# Altium schematic sheet power section.SchDoc
size A4; SheetNumber: 2; SheetTotal: 4
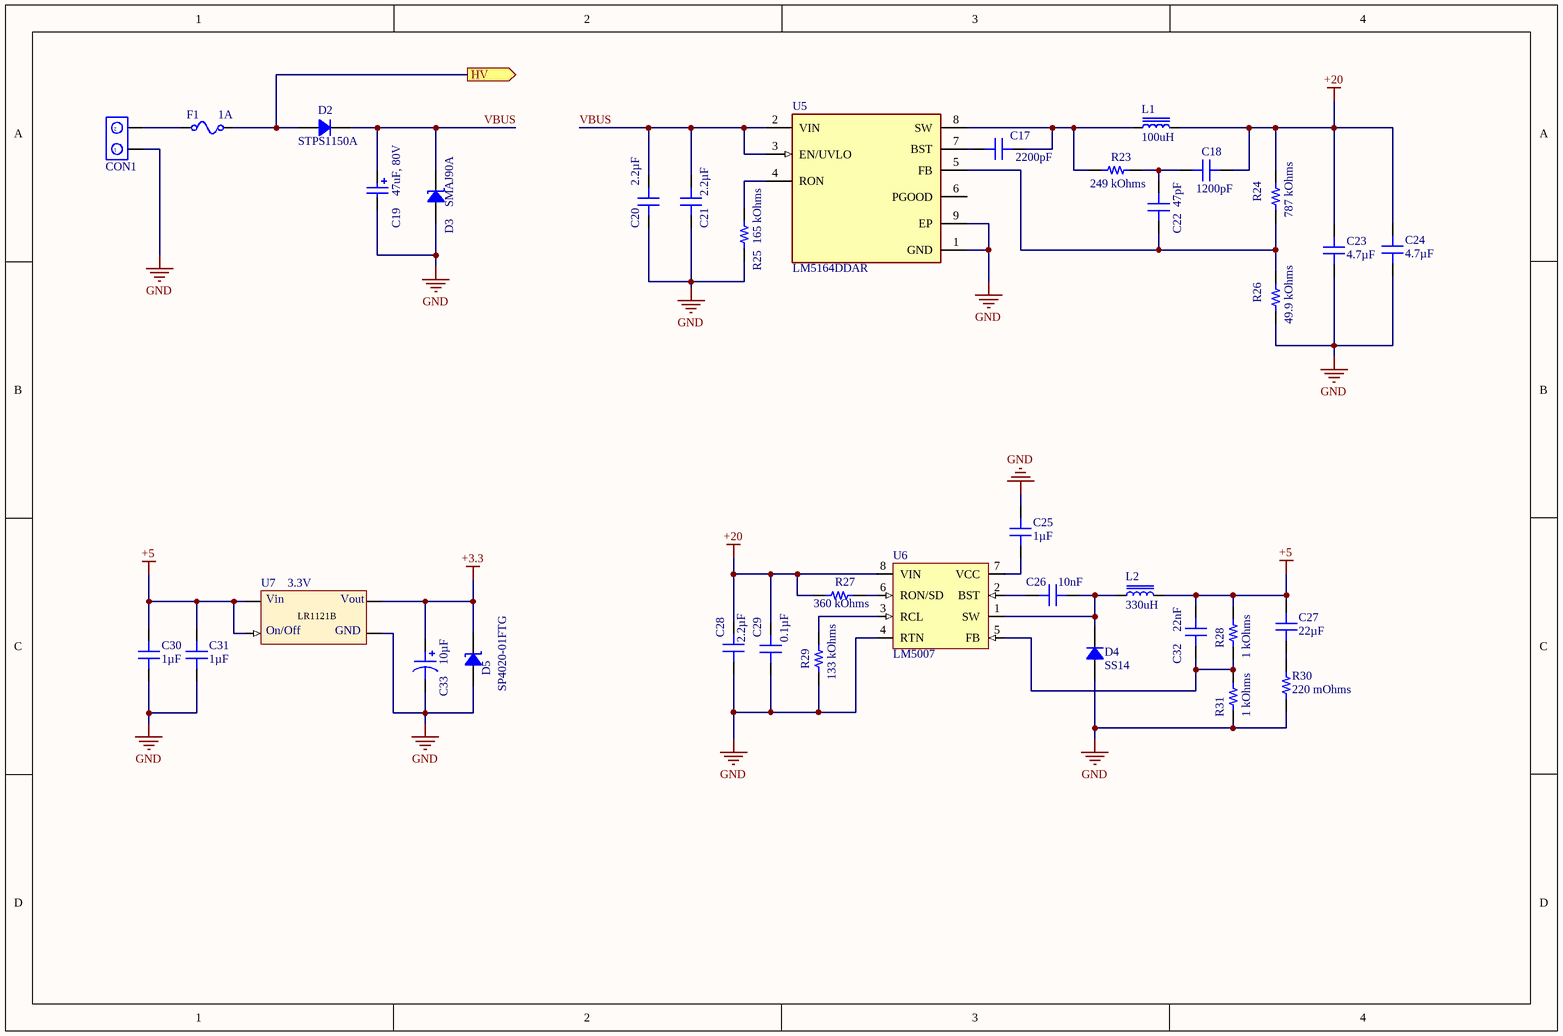
[diagram p0: power section.SchDoc]

## Parts
C17  2200pF  [CAP 1206_3216 - 1.2MM]
C18  1200pF  [CAP 0603_1608]
C19  47uF, 80V  [WCAP-ASLI_D10H10.5]
C20  2.2µF  [CAP 1210_3225 - 2.8MM]
C21  2.2µF  [CAP 1210_3225 - 2.8MM]
C22  47pF  [CAP 0603_1608]
C23  4.7µF  [CAP 0805_2012]
C24  4.7µF  [CAP 0805_2012]
C25  1µF  [CAP 0805_2012]
C26  10nF  [CAP 0402_1005]
C27  22µF  [CAP 1210_3225 - 2.8MM]
C28  2.2µF  [CAP 1206_3216 - 1.0MM]
C29  0.1µF  [CAP 0805_2012]
C30  1µF  [CAP 0402_1005]
C31  1µF  [CAP 0402_1005]
C32  22nF  [CAP 0603_1608]
C33  10µF  [CAP POL 1206_3216]
CON1  DG301-5.0-02P-12-00AH  [DG301-5.0-02P-12-00AH]  (value not drawn)
D2  STPS1150A  [DO214AC SMA]
D3  SMAJ90A  [DO214AC SMA]
D4  SS14  [DO214AC SMA]
D5  SP4020-01FTG  [SOD323]
F1  1A  [5x20 fuse holder clip R3-5A]
L1  100uH  [WE-PD_1245]
L2  330uH  [WE-PD_1245]
R23  249 kOhms  [RES 1206_3216]
R24  787 kOhms  [RES 1206_3216]
R25  165 kOhms  [RES 1206_3216]
R26  49.9 kOhms  [RES 1206_3216]
R27  360 kOhms  [RES 1206_3216]
R28  1 kOhms  [RES 1206_3216]
R29  133 kOhms  [RES 1206_3216]
R30  220 mOhms  [RES 1206_3216]
R31  1 kOhms  [RES 1206_3216]
U5  LM5164DDAR  [FP-DDA0008E-IPC_A]
U6  LM5007  [DGK0008A_L]
U7  3.3V  [SOT25_LR2111]

## Ports
HV (out)

## Nets
+3.3: C33.1 D5.2 U7.1(Vout)
+5: C27.2 C30.2 C31.2 C32.2 L2.2 R28.2 U7.3(Vin) U7.4(ON/OFF)
+20: C18.1 C23.2 C24.2 C28.2 C29.2 L1.2 R24.2 R27.1 U6.8(VIN)
GND: C19.2(N) C20.1 C21.1 C23.1 C24.1 C25.1 C28.1 C29.1 C30.1 C31.1 C33.2 CON1.1 D3.1 D4.1 D5.1 R25.1 R26.1 R29.1 R30.1 R31.1 U5.1(GND) U5.9(EP) U6.4(RTN) U7.2(Vss)
HV: D2.1 F1.2 ; port HV
VBUS: C19.1(P) C20.2 C21.2 D2.2 D3.2 U5.2(VIN) U5.3(EN/UVLO)
NetC17_1: C17.1 L1.1 R23.2 U5.8(SW)
NetC17_2: C17.2 U5.7(BST)
NetC18_2: C18.2 C22.2 R23.1
NetC22_1: C22.1 R24.1 R26.2 U5.5(FB)
NetC25_2: C25.2 U6.7(VCC)
NetC26_1: C26.1 U6.2(BST)
NetC26_2: C26.2 D4.2 L2.1 U6.1(SW)
NetC27_1: C27.1 R30.2
NetC32_1: C32.1 R28.1 R31.2 U6.5(FB)
NetCON1_2: CON1.2 F1.1
NetR25_2: R25.2 U5.4(RON)
NetR27_2: R27.2 U6.6(RON/SD)
NetR29_2: R29.2 U6.3(RCL)

Not connected (* = marked no-connect by the designer): U5 6(PGOOD)

## Notes on the sheet
- (in symbol LR1121B_3V3) LR1121B; On/Off; GND

## Library data of the parts
C17 = C1206C222K1GECAUTO: CAP CER 1206 2.2NF 100V C0G; Manufacturer: KEMET; Temperature Coefficient: C0G, NP0; Tolerance: ±10%; Part Number: C1206C222K1GECAUTO; Value: 2200pF; Applications: Automotive, ESD Protection; Capacitance: 2200pF; ComponentLink1Description: Datasheet; ComponentLink1URL: https://api.kemet.com/component-edge/download/datasheet/C1206C222K1GECAUTO.pdf; ComponentLink2Description: DigiKey Link; ComponentLink2URL: http://digikey.com/product-detail/en/kemet/C1206C222K1GECAUTO/399-17910-1-ND/8640577; Device Package: 1206 (3216 Metric); Features: Low ESL; LastUpdated: 9/2/2020 1:05:08 AM; Lifecycle Status: Active; Minimum Order: 1; Mounting Type: Surface Mount, MLCC; Operating Temperature: -55°C ~ 125°C; Package / Case: 1206 (3216 Metric); Packaging: TapeAndReel; PartId: 19238; Part Status: Active; Price: 0.07; Ratings: AEC-Q200; Series: ESD SMD Auto C0G; Size / Dimension: 0.126" L x 0.063" W (3.20mm x 1.60mm); Supplier 1: DigiKey; Supplier Part Number 1: 399-17910-1-ND; Thickness (Max): 0.047" (1.20mm); Voltage - Rated: 100V
C18 = C0603C122K1RAC7867: CAP CER 1200PF 100V X7R 0603; Manufacturer: KEMET; Tolerance: ±10%; Part Number: C0603C122K1RAC7867; Value: 1200pF; Applications: Bypass, Decoupling; Capacitance: 1200pF; ComponentLink1Description: Datasheet; ComponentLink1URL: https://api.kemet.com/component-edge/download/datasheet/C0603C122K1RACTU.pdf; ComponentLink2Description: DigiKey Link; ComponentLink2URL: http://digikey.com/product-detail/en/kemet/C0603C122K1RAC7867/399-15358-1-ND/7386756; Device Package: 0603 (1608 Metric); LastUpdated: 9/2/2020 1:03:35 AM; Lifecycle Status: Active; Minimum Order: 1; Mounting Type: Surface Mount, MLCC; Operating Temperature: -55°C ~ 125°C; Package / Case: 0603 (1608 Metric); Packaging: TapeAndReel; PartId: 2381; Part Status: Active; Price: 0.08; Series: SMD Comm X7R; Size / Dimension: 0.063" L x 0.031" W (1.60mm x 0.80mm); Supplier 1: DigiKey; Supplier Part Number 1: 399-15358-1-ND; Temperature Coefficient: X7R; Thickness (Max): 0.034" (0.87mm); Voltage - Rated: 100V
C19 = 865081757008: WCAP-ASLI Aluminum Electrolytic Capacitor, V-Chip, SMT, D10xH10.5mm, 47uF, 80V; Manufacturer: Wurth Elektronik; Technical Reference: ASEF105470M080DVCTEB000; Ripple Current: 160mA; Capacitance Tolerance: +/-20%; Leakage Current: 37.6uA; Endurance: 2000h; Dissipation Factor: 10%; Rated Voltage: 80VDC; Packaging: Tape and Reel; Published Date: October 2020; Operating Temperature: -55 to +105degC; Mounting Technology: SMT; Manufacturer Part Number: 865081757008; Height: 10.5mm; Capacitance: 47uF; ComponentLink1Description: Manufacturer; ComponentLink1URL: http://www.we-online.de; ComponentLink2Description: Datasheet; ComponentLink2URL: https://www.we-online.com/catalog/datasheet/865081757008.pdf; Diameter: 10mm
C20 C21 = HMK325B7225KM-P: CAP CER 2.2UF 100V X7R 1210; Manufacturer: Taiyo Yuden; Temperature Coefficient: X7R (2R1); Tolerance: ±10%; Part Number: HMK325B7225KM-P; Value: 2.2µF; Applications: Automotive, SMPS Filtering; Capacitance: 2.2µF; ComponentLink1Description: Datasheet; ComponentLink1URL: https://ds.yuden.co.jp/TYCOMPAS/ut/detail?pn=HMK325B7225KM-P &u=M; ComponentLink2Description: DigiKey Link; ComponentLink2URL: http://digikey.com/product-detail/en/taiyo-yuden/HMK325B7225KM-P/587-5395-1-ND/7066257; Device Package: 1210 (3225 Metric); LastUpdated: 9/2/2020 1:10:53 AM; Lifecycle Status: Active; Minimum Order: 1; Mounting Type: Surface Mount, MLCC; Operating Temperature: -55°C ~ 125°C; Package / Case: 1210 (3225 Metric); Packaging: TapeAndReel; PartId: 23634; Part Status: Active; Price: 0.15; Ratings: AEC-Q200; Series: M; Size / Dimension: 0.126" L x 0.098" W (3.20mm x 2.50mm); Supplier 1: DigiKey; Supplier Part Number 1: 587-5395-1-ND; Thickness (Max): 0.106" (2.70mm); Voltage - Rated: 100V
C22 = 06031A470FAT2A: CAP CER 47PF 100V C0G/NP0 0603; Manufacturer: AVX Corporation; Temperature Coefficient: C0G, NP0; Tolerance: ±1%; Part Number: 06031A470FAT2A; Value: 47pF; Applications: General Purpose; Capacitance: 47pF; ComponentLink1Description: Datasheet; ComponentLink1URL: http://datasheets.avx.com/C0GNP0-Dielectric.pdf; ComponentLink2Description: DigiKey Link; ComponentLink2URL: http://digikey.com/product-detail/en/avx-corporation/06031A470FAT2A/478-3691-1-ND/1116389; Device Package: 0603 (1608 Metric); LastUpdated: 9/2/2020 1:03:35 AM; Lifecycle Status: Active; Minimum Order: 1; Mounting Type: Surface Mount, MLCC; Operating Temperature: -55°C ~ 125°C; Package / Case: 0603 (1608 Metric); Packaging: TapeAndReel; PartId: 2637; Part Status: Active; Price: 0.10; Series: -; Size / Dimension: 0.063" L x 0.032" W (1.60mm x 0.81mm); Supplier 1: DigiKey; Supplier Part Number 1: 478-3691-1-ND; Thickness (Max): 0.035" (0.90mm); Voltage - Rated: 100V
C23 C24 = CL21A475KBQNNNE: CAP CER 4.7UF 50V X5R 0805; Manufacturer: Samsung Electro-Mechanics; Tolerance: ±10%; Part Number: CL21A475KBQNNNE; Value: 4.7µF; Applications: General Purpose; Capacitance: 4.7µF; ComponentLink1Description: Datasheet; ComponentLink1URL: http://www.samsungsem.com/kr/support/product-search/mlcc/CL21A475KBQNNNE.jsp; ComponentLink2Description: DigiKey Link; ComponentLink2URL: http://digikey.com/product-detail/en/samsung-electro-mechanics/CL21A475KBQNNNE/1276-1248-1-ND/3889334; Device Package: 0805 (2012 Metric); LastUpdated: 9/2/2020 1:04:41 AM; Lifecycle Status: Active; Minimum Order: 1; Mounting Type: Surface Mount, MLCC; Operating Temperature: -55°C ~ 85°C; Package / Case: 0805 (2012 Metric); Packaging: TapeAndReel; PartId: 3027; Part Status: Active; Price: 0.10; Series: CL; Size / Dimension: 0.079" L x 0.049" W (2.00mm x 1.25mm); Supplier 1: DigiKey; Supplier Part Number 1: 1276-1248-1-ND; Temperature Coefficient: X5R; Thickness (Max): 0.055" (1.40mm); Voltage - Rated: 50V
C25 = GCM21BR71H105KA03L: CAP CER 1UF 50V X7R 0805; Manufacturer: Murata Electronics; Tolerance: ±10%; Part Number: GCM21BR71H105KA03L; Value: 1µF; Applications: Automotive; Capacitance: 1µF; ComponentLink1Description: Datasheet; ComponentLink1URL: https://www.murata.com/~/media/webrenewal/support/library/catalog/products/capacitor/mlcc/c03e.ashx?la=en-us; ComponentLink2Description: DigiKey Link; ComponentLink2URL: http://digikey.com/product-detail/en/murata-electronics/GCM21BR71H105KA03L/490-10675-1-ND/5251430; Device Package: 0805 (2012 Metric); LastUpdated: 9/2/2020 1:04:41 AM; Lifecycle Status: Active; Minimum Order: 1; Mounting Type: Surface Mount, MLCC; Operating Temperature: -55°C ~ 125°C; Package / Case: 0805 (2012 Metric); Packaging: TapeAndReel; PartId: 2659; Part Status: Active; Price: 0.08; Ratings: AEC-Q200; Series: GCM; Size / Dimension: 0.079" L x 0.049" W (2.00mm x 1.25mm); Supplier 1: DigiKey; Supplier Part Number 1: 490-10675-1-ND; Temperature Coefficient: X7R; Thickness (Max): 0.055" (1.40mm); Voltage - Rated: 50V
C26 = C0402C103K4RECAUTO: CAP CER 0402 10NF 16V X7R 10%; Manufacturer: KEMET; Capacitance: 10000pF; Voltage - Rated: 50V; Part Number: C0402C103K4RECAUTO; Value: 10nF; Applications: Automotive, ESD Protection; ComponentLink1Description: Datasheet; ComponentLink1URL: https://api.kemet.com/component-edge/download/datasheet/C0402C103K4RECAUTO.pdf; ComponentLink2Description: DigiKey Link; ComponentLink2URL: http://digikey.com/product-detail/en/kemet/C0402C103K4RECAUTO/399-17876-1-ND/8640543; Device Package: 0402 (1005 Metric); LastUpdated: 9/2/2020 1:02:25 AM; Lifecycle Status: Active; Minimum Order: 1; Mounting Type: Surface Mount, MLCC; Operating Temperature: -55°C ~ 125°C; Package / Case: 0402 (1005 Metric); Packaging: TapeAndReel; PartId: 1725; Part Status: Active; Price: 0.02; Ratings: AEC-Q200; Series: ESD SMD Auto X7R; Size / Dimension: 0.039" L x 0.020" W (1.00mm x 0.50mm); Supplier 1: DigiKey; Supplier Part Number 1: 399-17876-1-ND; Temperature Coefficient: X7R; Thickness (Max): 0.022" (0.55mm); Tolerance: ±10%
C27 = C3225X7R1E226M250AB: CAP CER 22UF 25V X7R 1210; Manufacturer: TDK Corporation; Tolerance: ±20%; Part Number: C3225X7R1E226M250AB; Value: 22µF; Applications: General Purpose; Capacitance: 22µF; ComponentLink1Description: Datasheet; ComponentLink1URL: https://product.tdk.com/en/search/capacitor/ceramic/mlcc/info?part_no=C2012X7S1E106K125AC?ref_disty=digikey; ComponentLink2Description: DigiKey Link; ComponentLink2URL: http://digikey.com/product-detail/en/tdk-corporation/C3225X7R1E226M250AB/445-181602-1-ND/9991480; Device Package: 1210 (3225 Metric); Features: Low ESL; LastUpdated: 9/2/2020 1:10:53 AM; Lifecycle Status: Active; Minimum Order: 1; Mounting Type: Surface Mount, MLCC; Operating Temperature: -55°C ~ 125°C; Package / Case: 1210 (3225 Metric); Packaging: TapeAndReel; PartId: 23664; Part Status: Active; Price: 0.63; Series: C; Size / Dimension: 0.126" L x 0.098" W (3.20mm x 2.50mm); Supplier 1: DigiKey; Supplier Part Number 1: 445-181602-1-ND; Temperature Coefficient: X7R; Thickness (Max): 0.110" (2.80mm); Voltage - Rated: 25V
C28 = UMK316B7225MD-T: CAP CER 2.2UF 50V X7R 1206; Manufacturer: Taiyo Yuden; Tolerance: ±20%; Part Number: UMK316B7225MD-T; Value: 2.2µF; Applications: General Purpose; Capacitance: 2.2µF; ComponentLink1Description: Datasheet; ComponentLink1URL: https://ds.yuden.co.jp/TYCOMPAS/ut/detail?pn=UMK316B7225MD-T  &u=M; ComponentLink2Description: DigiKey Link; ComponentLink2URL: http://digikey.com/product-detail/en/taiyo-yuden/UMK316B7225MD-T/587-5601-1-ND/7067276; Device Package: 1206 (3216 Metric); LastUpdated: 9/2/2020 1:05:04 AM; Lifecycle Status: Active; Minimum Order: 1; Mounting Type: Surface Mount, MLCC; Operating Temperature: -55°C ~ 125°C; Package / Case: 1206 (3216 Metric); Packaging: TapeAndReel; PartId: 19453; Part Status: Active; Price: 0.08; Series: M; Size / Dimension: 0.126" L x 0.063" W (3.20mm x 1.60mm); Supplier 1: DigiKey; Supplier Part Number 1: 587-5601-1-ND; Temperature Coefficient: X7R; Thickness (Max): 0.037" (0.95mm); Voltage - Rated: 50V
C29 = AC0805KKX8R9BB104: CAP CER 0805 10% X8R 50V 100NF; Manufacturer: Yageo; Part Number: AC0805KKX8R9BB104; Value: 0.1µF; Applications: Automotive; Capacitance: 0.1µF; ComponentLink1Description: Datasheet; ComponentLink1URL: http://www.yageo.com/documents/recent/AC0805KKX8R9BB104.pdf; ComponentLink2Description: DigiKey Link; ComponentLink2URL: http://digikey.com/product-detail/en/yageo/AC0805KKX8R9BB104/311-4624-1-ND/9699550; Device Package: 0805 (2012 Metric); LastUpdated: 9/2/2020 1:04:20 AM; Lifecycle Status: Active; Minimum Order: 1; Mounting Type: Surface Mount, MLCC; Operating Temperature: -55°C ~ 150°C; Package / Case: 0805 (2012 Metric); Packaging: TapeAndReel; PartId: 14076; Part Status: Active; Price: 0.06; Ratings: AEC-Q200; Series: AC; Size / Dimension: 0.079" L x 0.049" W (2.00mm x 1.25mm); Supplier 1: DigiKey; Supplier Part Number 1: 311-4624-1-ND; Temperature Coefficient: X8R; Thickness (Max): 0.057" (1.45mm); Tolerance: ±10%; Voltage - Rated: 50V
C30 C31 = GRM155C71A105KE11D: CAP CER 1UF 10V X7S 0402; Manufacturer: Murata Electronics; Tolerance: ±10%; Part Number: GRM155C71A105KE11D; Value: 1µF; Applications: General Purpose; Capacitance: 1µF; ComponentLink1Description: Datasheet; ComponentLink1URL: https://search.murata.co.jp/Ceramy/image/img/A01X/G101/ENG/GRM155C71A105KE11-01.pdf; ComponentLink2Description: DigiKey Link; ComponentLink2URL: http://digikey.com/product-detail/en/murata-electronics/GRM155C71A105KE11D/490-14457-1-ND/6606918; Device Package: 0402 (1005 Metric); LastUpdated: 9/2/2020 1:02:25 AM; Lifecycle Status: Active; Minimum Order: 1; Mounting Type: Surface Mount, MLCC; Operating Temperature: -55°C ~ 125°C; Package / Case: 0402 (1005 Metric); Packaging: TapeAndReel; PartId: 1749; Part Status: Active; Price: 0.08; Series: GRM; Size / Dimension: 0.039" L x 0.020" W (1.00mm x 0.50mm); Supplier 1: DigiKey; Supplier Part Number 1: 490-14457-1-ND; Temperature Coefficient: X7S; Thickness (Max): 0.024" (0.60mm); Voltage - Rated: 10V
C32 = 06035C222JAT2A: CAP CER 2200PF 50V X7R 0603; Manufacturer: AVX Corporation; Tolerance: ±5%; Part Number: 06035C222JAT2A; Value: 22nF; Applications: General Purpose; Capacitance: 2200pF; ComponentLink1Description: Datasheet; ComponentLink1URL: http://datasheets.avx.com/X7RDielectric.pdf; ComponentLink2Description: DigiKey Link; ComponentLink2URL: http://digikey.com/product-detail/en/avx-corporation/06035C222JAT2A/478-6205-1-ND/2391404; Device Package: 0603 (1608 Metric); LastUpdated: 9/2/2020 1:03:35 AM; Lifecycle Status: Active; Minimum Order: 1; Mounting Type: Surface Mount, MLCC; Operating Temperature: -55°C ~ 125°C; Package / Case: 0603 (1608 Metric); Packaging: TapeAndReel; PartId: 2770; Part Status: Active; Price: 0.02; Series: -; Size / Dimension: 0.063" L x 0.032" W (1.60mm x 0.81mm); Supplier 1: DigiKey; Supplier Part Number 1: 478-6205-1-ND; Temperature Coefficient: X7R; Thickness (Max): 0.035" (0.90mm); Voltage - Rated: 50V
C33 = T491S106K010AT: CAP TANT 10UF 10% 10V 1206; Manufacturer: KEMET; Manufacturer Size Code: S; ESR (Equivalent Series Resistance): 15Ohm; Lifetime @ Temp.: 2000 Hrs @ 125°C; Type: Molded; Part Number: T491S106K010AT; Value: 10µF; Capacitance: 10µF; ComponentLink1Description: Datasheet; ComponentLink1URL: https://api.kemet.com/component-edge/download/datasheet/T491S106K010AT.pdf; ComponentLink2Description: DigiKey Link; ComponentLink2URL: http://digikey.com/product-detail/en/kemet/T491S106K010AT/399-9747-1-ND/3724860; Device Package: 1206 (3216 Metric); Features: General Purpose; Height - Seated (Max): 0.047" (1.20mm); LastUpdated: 9/2/2020 1:15:59 AM; Lifecycle Status: Active; Minimum Order: 1; Mounting Type: Surface Mount; Operating Temperature: -55°C ~ 125°C; Package / Case: 1206 (3216 Metric); Packaging: TapeAndReel; PartId: 113; Part Status: Active; Price: 0.48; Series: T491; Size / Dimension: 0.126" L x 0.063" W (3.20mm x 1.60mm); Supplier 1: DigiKey; Supplier Part Number 1: 399-9747-1-ND; Tolerance: ±10%; Voltage - Rated: 10V
D2 = STPS1150A: DIODE SCHOTTKY 150V 1A SMA; Manufacturer: STMicroelectronics; Current - Reverse Leakage @ Vr: 1µA @ 150V; Speed: Fast Recovery =< 500ns, > 200mA (Io); Voltage - Forward (Vf) (Max) @ If: 820mV @ 1A; Part Number: STPS1150A; ComponentLink1Description: Datasheet; ComponentLink1URL: http://www.st.com/content/ccc/resource/technical/document/datasheet/c8/2f/54/15/4c/14/44/bb/CD00003321.pdf/files/CD00003321.pdf/jcr:content/translations/en.CD00003321.pdf; ComponentLink2Description: DigiKey Link; ComponentLink2URL: http://digikey.com/product-detail/en/stmicroelectronics/STPS1150A/497-7545-1-ND/1883390; Current - Average Rectified (Io): 1A; Diode Type: Schottky; LastUpdated: 9/2/2020 1:19:02 AM; Lifecycle Status: Active; Minimum Order: 1; Mounting Type: Surface Mount; Operating Temperature - Junction: 175°C (Max); Package / Case: DO-214AC, SMA; Packaging: TapeAndReel; PartId: 2076; Part Status: Active; Price: 0.09; Series: -; Supplier 1: DigiKey; Supplier Part Number 1: 497-7545-1-ND; Supplier Device Package: SMA; Voltage - DC Reverse (Vr) (Max): 150V
D3 = SMAJ90A: TVS DIODE 90V 146V SMA; Manufacturer: AVX Corporation; Current - Peak Pulse (10/1000µs): 2.74A; Power Line Protection: No; Power - Peak Pulse: 400W; Type: Zener; Unidirectional Channels: 1; Voltage - Breakdown (Min): 100V; Part Number: SMAJ90A; Applications: General Purpose; ComponentLink1Description: Datasheet; ComponentLink1URL: //media.digikey.com/pdf/Data%20Sheets/AVX%20PDFs/Transient%20Suppression%20Diodes.pdf; ComponentLink2Description: DigiKey Link; ComponentLink2URL: http://digikey.com/product-detail/en/avx-corporation/SMAJ90A/478-7059-1-ND/3340336; LastUpdated: 9/2/2020 1:20:14 AM; Lifecycle Status: Active; Minimum Order: 1; Mounting Type: Surface Mount; Operating Temperature: -55°C ~ 150°C (TJ); Package / Case: DO-214AC, SMA; Packaging: TapeAndReel; PartId: 5678; Part Status: Active; Price: 0.10; Series: -; Supplier 1: DigiKey; Supplier Part Number 1: 478-7059-1-ND; Supplier Device Package: SMAJ (DO-214AC); Voltage - Clamping (Max) @ Ipp: 146V; Voltage - Reverse Standoff (Typ): 90V
D4 = SS14: DIODE SCHOTTKY 40V 1A SMA; Manufacturer: ON Semiconductor; Current - Reverse Leakage @ Vr: 200µA @ 40V; Speed: Fast Recovery =< 500ns, > 200mA (Io); Voltage - Forward (Vf) (Max) @ If: 500mV @ 1A; Part Number: SS14; ComponentLink1Description: Datasheet; ComponentLink1URL: https://www.onsemi.com/pub/Collateral/SS19-D.PDF; ComponentLink2Description: DigiKey Link; ComponentLink2URL: http://digikey.com/product-detail/en/on-semiconductor/SS14/SS14CT-ND/965729; Current - Average Rectified (Io): 1A; Diode Type: Schottky; LastUpdated: 9/2/2020 1:19:04 AM; Lifecycle Status: Active; Minimum Order: 1; Mounting Type: Surface Mount; Operating Temperature - Junction: -65°C ~ 125°C; Package / Case: DO-214AC, SMA; Packaging: TapeAndReel; PartId: 1885; Part Status: Active; Price: 0.06; Series: -; Supplier 1: DigiKey; Supplier Part Number 1: SS14CT-ND; Supplier Device Package: SMA (DO-214AC); Voltage - DC Reverse (Vr) (Max): 40V
D5 = SP4020-01FTG: TVS DIODE 3.3V 21.8V SOD323; Manufacturer: Littelfuse Inc.; Capacitance @ Frequency: 2.5pF @ 1MHz; Current - Peak Pulse (10/1000µs): 30A (8/20µs); Power Line Protection: No; Power - Peak Pulse: 750W; Type: Steering (Rail to Rail); Unidirectional Channels: 1; Voltage - Breakdown (Min): 3.5V; Voltage - Clamping (Max) @ Ipp: 21.8V (Typ); Voltage - Reverse Standoff (Typ): 3.3V (Max); Part Number: SP4020-01FTG; Applications: Ethernet; ComponentLink1Description: Datasheet; ComponentLink1URL: https://www.littelfuse.com/~/media/electronics/datasheets/tvs_diode_arrays/littelfuse_tvs_diode_array_sp4020_datasheet.pdf.pdf; ComponentLink2Description: DigiKey Link; ComponentLink2URL: http://digikey.com/product-detail/en/littelfuse-inc/SP4020-01FTG/F6270CT-ND/4579604; LastUpdated: 9/2/2020 1:28:27 AM; Lifecycle Status: Active; Minimum Order: 1; Mounting Type: Surface Mount; Operating Temperature: -40°C ~ 125°C (TJ); Package / Case: SC-76, SOD-323; Packaging: TapeAndReel; PartId: 9868; Part Status: Active; Price: 0.22; Series: SP4020, SPA®; Supplier 1: DigiKey; Supplier Part Number 1: F6270CT-ND; Supplier Device Package: SOD-323
F1 = 5x20 fuse: 5x20 fuse holder clip; Value: 1A
L1 = CDRH127-101M: 330uh 1A Shielded Fixed inductor COREMASTER; Current: 3.28A; DCR: 170m; Tolerance: 20%; Value: 100uH; Dimensions: 12x12x8; ComponentLink1Description: ozdisan; ComponentLink1URL: https://ozdisan.com/passive-components/inductors/fixed-inductors/SRI1204-331M
L2 = SRI1204-331M: 330uh 1A Shielded Fixed inductor COREMASTER; DCR: 800m; Tolerance: 20%; Value: 330uH; Current: 1A; Dimensions: 12x12x5; ComponentLink1Description: ozdisan; ComponentLink1URL: https://ozdisan.com/passive-components/inductors/fixed-inductors/SRI1204-331M
R23 = CRCW1206249KFKEA: RES SMD 249K OHM 1% 1/4W 1206; Manufacturer: Vishay Dale; Power (Watts): 0.25W, 1/4W; Temperature Coefficient: ±100ppm/°C; Part Number: CRCW1206249KFKEA; ComponentLink1Description: Datasheet; ComponentLink1URL: http://www.vishay.com/docs/20035/dcrcwe3.pdf; ComponentLink2Description: DigiKey Link; ComponentLink2URL: http://digikey.com/product-detail/en/vishay-dale/CRCW1206249KFKEA/541-249KFCT-ND/1182031; Composition: Thick Film; Device Package: 1206 (3216 Metric); Features: Automotive AEC-Q200; Height - Seated (Max): 0.024" (0.60mm); LastUpdated: 9/2/2020 1:13:11 AM; Lifecycle Status: Active; Minimum Order: 1; Number of Terminations: 2; Operating Temperature: -55°C ~ 155°C; Package / Case: 1206 (3216 Metric); Packaging: TapeAndReel; PartId: 26922; Part Status: Active; Price: 0.01; Ratings: AEC-Q200; Resistance: 249 kOhms; Series: CRCW; Size / Dimension: 0.126" L x 0.063" W (3.20mm x 1.60mm); Supplier 1: DigiKey; Supplier Part Number 1: 541-249KFCT-ND; Supplier Device Package: 1206; Tolerance: ±1%; Value: 249 kOhms
R24 = RMCF1206FT787K: RES 787K OHM 1% 1/4W 1206; Manufacturer: Stackpole Electronics Inc; Power (Watts): 0.25W, 1/4W; Temperature Coefficient: ±100ppm/°C; Part Number: RMCF1206FT787K; ComponentLink1Description: Datasheet; ComponentLink1URL: https://www.seielect.com/catalog/sei-rmcf_rmcp.pdf; ComponentLink2Description: DigiKey Link; ComponentLink2URL: http://digikey.com/product-detail/en/stackpole-electronics-inc/RMCF1206FT787K/RMCF1206FT787KCT-ND/5049901; Composition: Thick Film; Device Package: 1206 (3216 Metric); Features: Automotive AEC-Q200; Height - Seated (Max): 0.028" (0.70mm); LastUpdated: 9/2/2020 1:13:01 AM; Lifecycle Status: Active; Minimum Order: 1; Number of Terminations: 2; Operating Temperature: -55°C ~ 155°C; Package / Case: 1206 (3216 Metric); Packaging: CutTape; PartId: 30593; Part Status: Active; Price: 0.10; Ratings: AEC-Q200; Resistance: 787 kOhms; Series: RMCF; Size / Dimension: 0.126" L x 0.063" W (3.20mm x 1.60mm); Supplier 1: DigiKey; Supplier Part Number 1: RMCF1206FT787KCT-ND; Supplier Device Package: 1206; Tolerance: ±1%; Value: 787 kOhms
R25 = CRCW1206165KFKEA: RES SMD 165K OHM 1% 1/4W 1206; Manufacturer: Vishay Dale; Power (Watts): 0.25W, 1/4W; Temperature Coefficient: ±100ppm/°C; Part Number: CRCW1206165KFKEA; ComponentLink1Description: Datasheet; ComponentLink1URL: http://www.vishay.com/docs/20035/dcrcwe3.pdf; ComponentLink2Description: DigiKey Link; ComponentLink2URL: http://digikey.com/product-detail/en/vishay-dale/CRCW1206165KFKEA/541-165KFCT-ND/1182011; Composition: Thick Film; Device Package: 1206 (3216 Metric); Features: Automotive AEC-Q200; Height - Seated (Max): 0.024" (0.60mm); LastUpdated: 9/2/2020 1:13:03 AM; Lifecycle Status: Active; Minimum Order: 1; Number of Terminations: 2; Operating Temperature: -55°C ~ 155°C; Package / Case: 1206 (3216 Metric); Packaging: TapeAndReel; PartId: 29728; Part Status: Active; Price: 0.01; Ratings: AEC-Q200; Resistance: 165 kOhms; Series: CRCW; Size / Dimension: 0.126" L x 0.063" W (3.20mm x 1.60mm); Supplier 1: DigiKey; Supplier Part Number 1: 541-165KFCT-ND; Supplier Device Package: 1206; Tolerance: ±1%; Value: 165 kOhms
R26 = AC1206FR-0749K9L: RES SMD 49.9K OHM 1% 1/4W 1206; Manufacturer: Yageo; Power (Watts): 0.25W, 1/4W; Temperature Coefficient: ±100ppm/°C; Part Number: AC1206FR-0749K9L; ComponentLink1Description: Datasheet; ComponentLink1URL: https://www.yageo.com/upload/media/product/productsearch/datasheet/rchip/PYu-AC_51_RoHS_L_7.pdf; ComponentLink2Description: DigiKey Link; ComponentLink2URL: http://digikey.com/product-detail/en/yageo/AC1206FR-0749K9L/YAG5409CT-ND/7063752; Composition: Thick Film; Device Package: 1206 (3216 Metric); Features: Automotive AEC-Q200, Moisture Resistant; Height - Seated (Max): 0.026" (0.65mm); LastUpdated: 9/2/2020 1:13:11 AM; Lifecycle Status: Active; Minimum Order: 1; Number of Terminations: 2; Operating Temperature: -55°C ~ 155°C; Package / Case: 1206 (3216 Metric); Packaging: TapeAndReel; PartId: 26899; Part Status: Active; Price: 0.01; Ratings: AEC-Q200; Resistance: 49.9 kOhms; Series: AC; Size / Dimension: 0.122" L x 0.063" W (3.10mm x 1.60mm); Supplier 1: DigiKey; Supplier Part Number 1: YAG5409CT-ND; Supplier Device Package: 1206; Tolerance: ±1%; Value: 49.9 kOhms
R27 = RC1206FR-07360KL: RES SMD 360K OHM 1% 1/4W 1206; Manufacturer: Yageo; Power (Watts): 0.25W, 1/4W; Temperature Coefficient: ±100ppm/°C; Part Number: RC1206FR-07360KL; ComponentLink1Description: Datasheet; ComponentLink1URL: https://www.yageo.com/upload/media/product/productsearch/datasheet/rchip/PYu-RC_Group_51_RoHS_L_10.pdf; ComponentLink2Description: DigiKey Link; ComponentLink2URL: http://digikey.com/product-detail/en/yageo/RC1206FR-07360KL/311-360KFRCT-ND/731790; Composition: Thick Film; Device Package: 1206 (3216 Metric); Features: Moisture Resistant; Height - Seated (Max): 0.026" (0.65mm); LastUpdated: 9/2/2020 1:13:06 AM; Lifecycle Status: Active; Minimum Order: 1; Number of Terminations: 2; Operating Temperature: -55°C ~ 155°C; Package / Case: 1206 (3216 Metric); Packaging: TapeAndReel; PartId: 28271; Part Status: Active; Price: 0.01; Resistance: 360 kOhms; Series: RC; Size / Dimension: 0.122" L x 0.063" W (3.10mm x 1.60mm); Supplier 1: DigiKey; Supplier Part Number 1: 311-360KFRCT-ND; Supplier Device Package: 1206; Tolerance: ±1%; Value: 360 kOhms
R28 R31 = RC1206FR-071KL: RES SMD 1K OHM 1% 1/4W 1206; Manufacturer: Yageo; Power (Watts): 0.25W, 1/4W; Temperature Coefficient: ±100ppm/°C; Part Number: RC1206FR-071KL; ComponentLink1Description: Datasheet; ComponentLink1URL: https://www.yageo.com/upload/media/product/productsearch/datasheet/rchip/PYu-RC_Group_51_RoHS_L_10.pdf; ComponentLink2Description: DigiKey Link; ComponentLink2URL: http://digikey.com/product-detail/en/yageo/RC1206FR-071KL/311-1.00KFRCT-ND/731334; Composition: Thick Film; Device Package: 1206 (3216 Metric); Features: Moisture Resistant; Height - Seated (Max): 0.026" (0.65mm); LastUpdated: 9/2/2020 1:13:10 AM; Lifecycle Status: Active; Minimum Order: 1; Number of Terminations: 2; Operating Temperature: -55°C ~ 155°C; Package / Case: 1206 (3216 Metric); Packaging: TapeAndReel; PartId: 26978; Part Status: Active; Price: 0.01; Resistance: 1 kOhms; Series: RC; Size / Dimension: 0.122" L x 0.063" W (3.10mm x 1.60mm); Supplier 1: DigiKey; Supplier Part Number 1: 311-1.00KFRCT-ND; Supplier Device Package: 1206; Tolerance: ±1%; Value: 1 kOhms
R29 = RC1206FR-07133KL: RES SMD 133K OHM 1% 1/4W 1206; Manufacturer: Yageo; Power (Watts): 0.25W, 1/4W; Temperature Coefficient: ±100ppm/°C; Part Number: RC1206FR-07133KL; ComponentLink1Description: Datasheet; ComponentLink1URL: https://www.yageo.com/upload/media/product/productsearch/datasheet/rchip/PYu-RC_Group_51_RoHS_L_10.pdf; ComponentLink2Description: DigiKey Link; ComponentLink2URL: http://digikey.com/product-detail/en/yageo/RC1206FR-07133KL/311-133KFRCT-ND/731487; Composition: Thick Film; Device Package: 1206 (3216 Metric); Features: Moisture Resistant; Height - Seated (Max): 0.026" (0.65mm); LastUpdated: 9/2/2020 1:12:56 AM; Lifecycle Status: Active; Minimum Order: 1; Number of Terminations: 2; Operating Temperature: -55°C ~ 155°C; Package / Case: 1206 (3216 Metric); Packaging: TapeAndReel; PartId: 32407; Part Status: Active; Price: 0.01; Resistance: 133 kOhms; Series: RC; Size / Dimension: 0.122" L x 0.063" W (3.10mm x 1.60mm); Supplier 1: DigiKey; Supplier Part Number 1: 311-133KFRCT-ND; Supplier Device Package: 1206; Tolerance: ±1%; Value: 133 kOhms
R30 = RMCF1206FTR220: RES 0.22 OHM 1% 1/4W 1206; Manufacturer: Stackpole Electronics Inc; Power (Watts): 0.25W, 1/4W; Temperature Coefficient: ±200ppm/°C; Part Number: RMCF1206FTR220; ComponentLink1Description: Datasheet; ComponentLink1URL: https://www.seielect.com/catalog/sei-rmcf_rmcp.pdf; ComponentLink2Description: DigiKey Link; ComponentLink2URL: http://digikey.com/product-detail/en/stackpole-electronics-inc/RMCF1206FTR220/RMCF1206FCT220CT-ND/4376703; Composition: Thick Film; Device Package: 1206 (3216 Metric); Features: Automotive AEC-Q200; Height - Seated (Max): 0.028" (0.70mm); LastUpdated: 9/2/2020 1:13:01 AM; Lifecycle Status: Active; Minimum Order: 1; Number of Terminations: 2; Operating Temperature: -55°C ~ 155°C; Package / Case: 1206 (3216 Metric); Packaging: TapeAndReel; PartId: 30370; Part Status: Active; Price: 0.08; Ratings: AEC-Q200; Resistance: 220 mOhms; Series: RMCF; Size / Dimension: 0.126" L x 0.063" W (3.20mm x 1.60mm); Supplier 1: DigiKey; Supplier Part Number 1: RMCF1206FCT220CT-ND; Supplier Device Package: 1206; Tolerance: ±1%; Value: 220 mOhms
U5 = LM5164DDAR: POWER MANAGEMENT; Manufacturer: Texas Instruments; Standoff Height: 0mm; Max Supply Voltage: 100V; Output Voltage: 1.2-90V; Max Duty Cycle: 99%; Nominal Supply Current: 600uA; Output Current: 1A; Min Supply Voltage: 6V; Output Type: AdjustableProgrammable; Max Junction Temp: +150°C; Number Of Outputs: 1; Switching Frequency: 1000kHz; Switching Topology: Buck; Temperature: -40°C to +150°C; Device Class L1: Integrated Circuits (ICs); Automotive: No; Lead Free: Yes; Package: DDA0008E; Device Class L3: Voltage Regulators - Switching; Manufacturer Part Number: LM5164DDAR; Device Class L2: Power Management ICs; RoHS: TRUE; Mouser Description: 6-V to 100-V input, 1-A synchronous buck DC-DC converter with ultra-low IQ 8-SO PowerPAD -40 to 150; Temperature Range Low: -40°C; ComponentLink2Description: Datasheet; Temperature Range High: +150°C; ComponentLink2URL: http://www.ti.com/lit/ds/symlink/lm5164.pdf; Digikey Description: POWER MANAGEMENT; Category: IC; Octopart: https://octopart.com/lm5164ddar-texas+instruments-96785744
U6 = LM5007MM: High Voltage (80V) Step Down Switching Regulator, 8-pin MSOP; Manufacturer: Texas Instruments; PackageTopMarking: ZXTT*S81B; PowerWise: N; CompType: Switcher; ComponentLink1URL: http://www.ti.com/general/docs/lit/getliterature.tsp?genericPartNumber=LM5007&fileType=pdf; PinCount: 8; RoHS: N; PackageDescription: MINI SOIC, .118 x .118 x .034in, 8 Lead, .0256in Pitch; PackageReference: DGK0008A; Code_JEDEC: MO-187-AA; ComponentLink1Description: Datasheet URL
U7 = LR1121B_3V3: 200mA 7V LDO; Value: 3.3V